# Altium project S905D_MIC_V1.0.PrjPcb
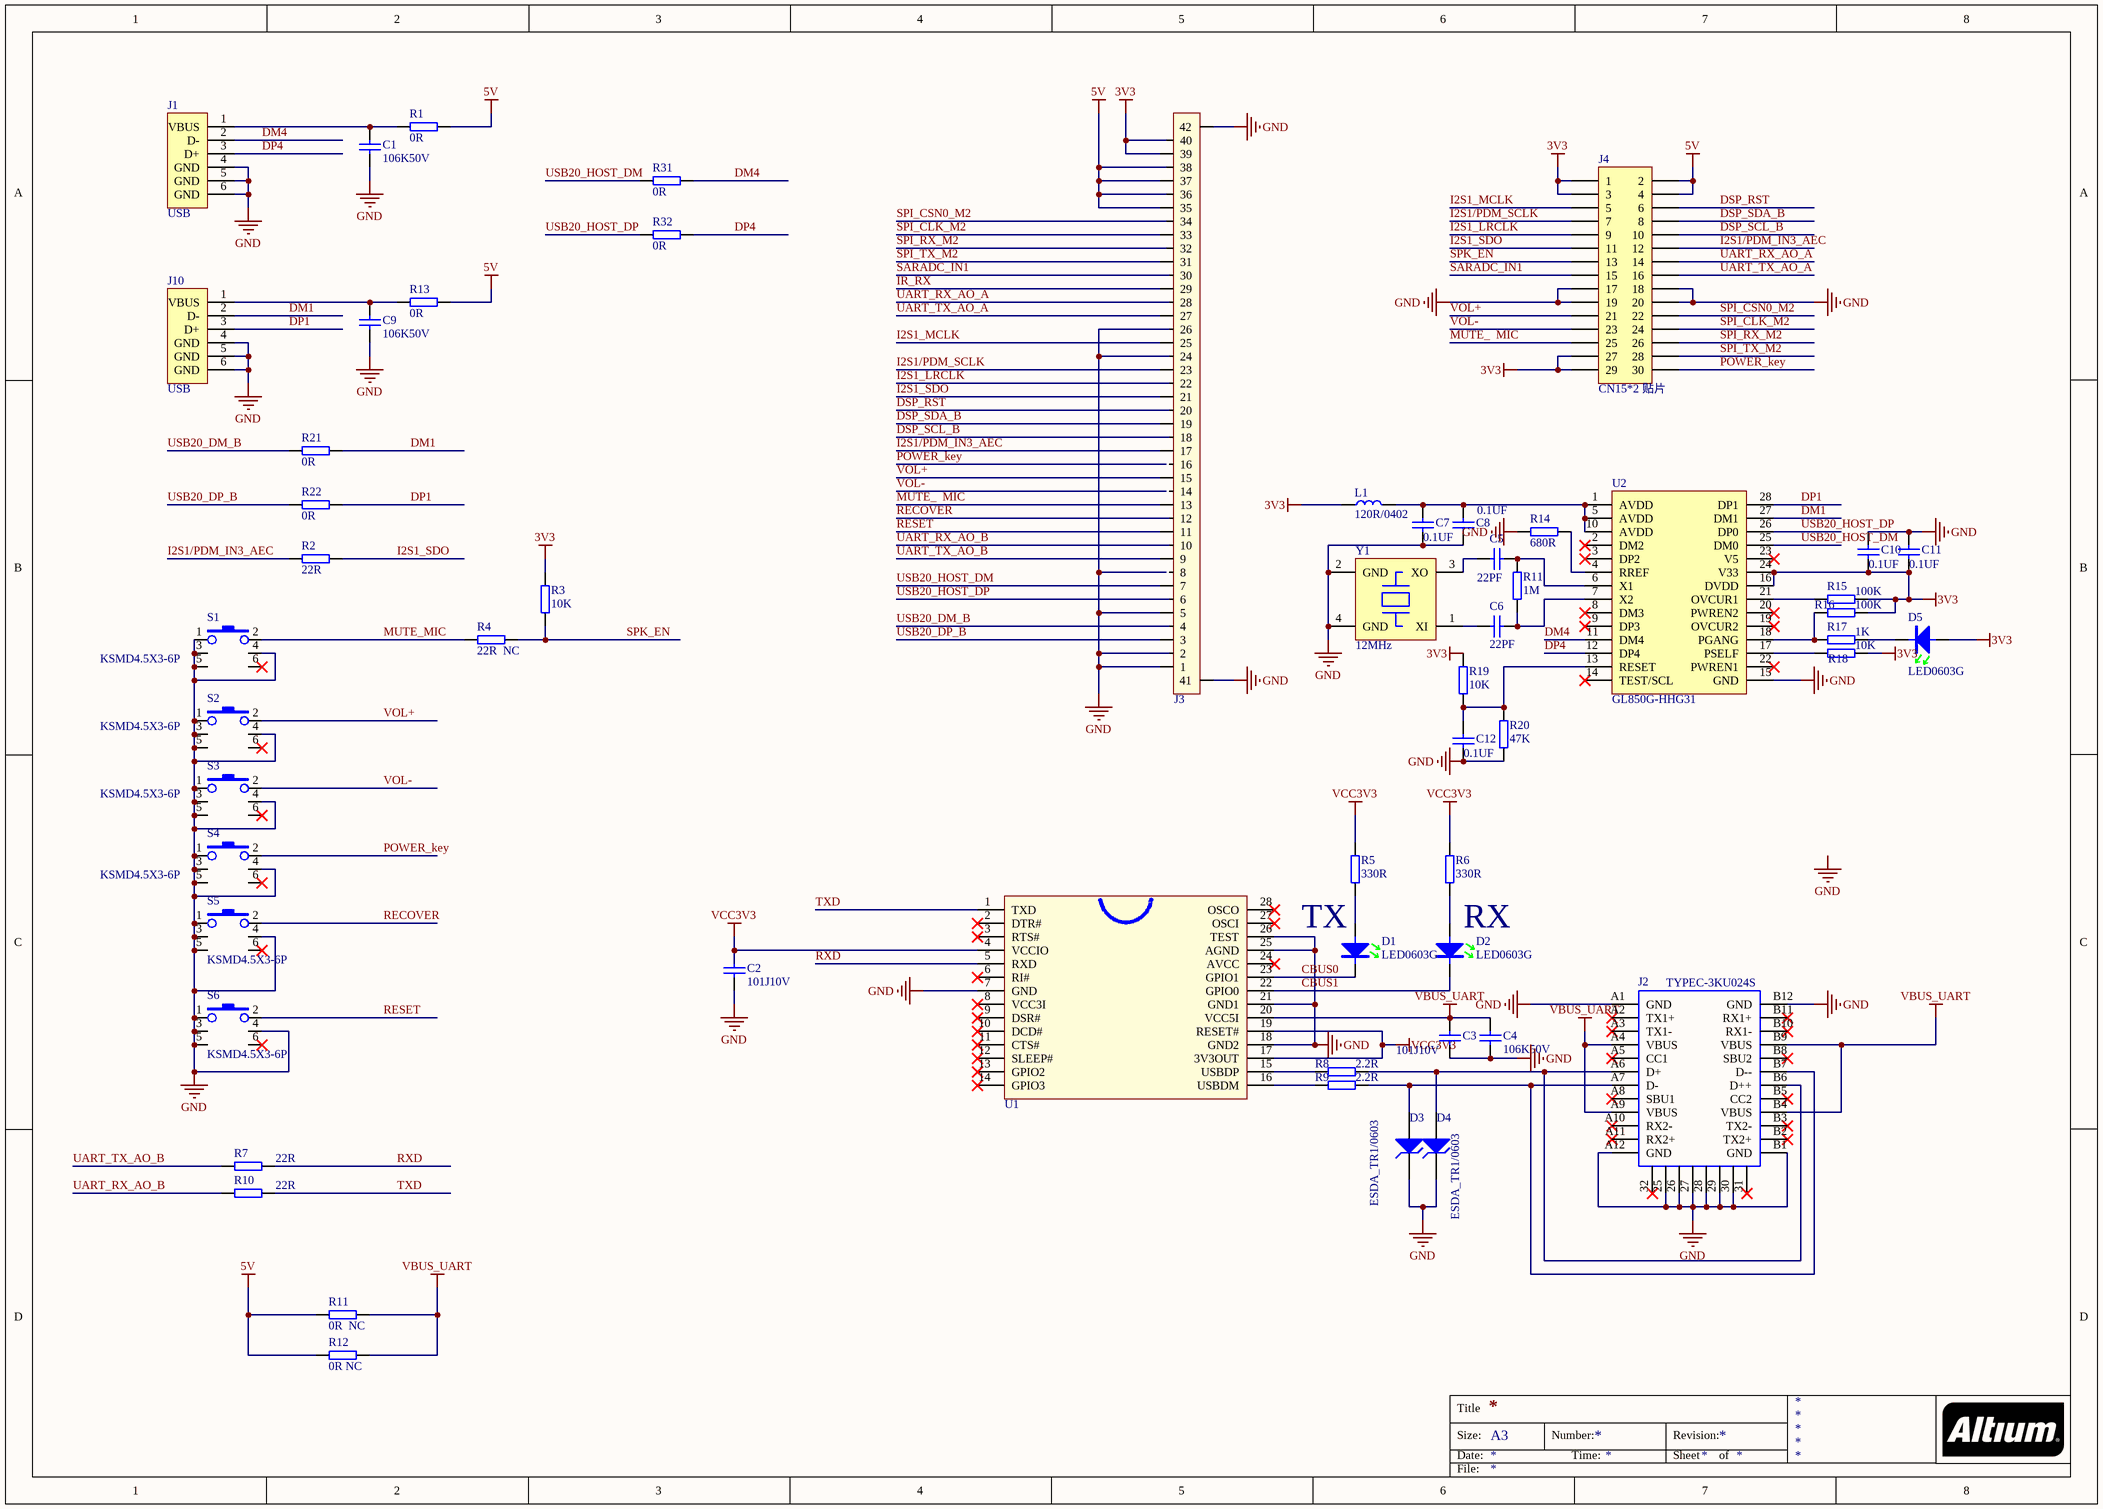
[diagram p0: S905D_MIC_V1.0.SchDoc]
1 sheet, 57 parts. Net scope: global (net labels, ports and power ports of the same name join across sheets).
Board file: S905D_MIC_V1.0.PcbDoc

## Sheet S905D_MIC_V1.0.SchDoc
size A3; PageSetup: Record=PageOptions|CenterHorizontal=True|CenterVertical=True|PrintScale=0.66|XCorrection=1.00|YCorrection=1.00|PrintKind=1|BorderSize=5000000|LeftOffset=0|BottomOffset=0|Orientation=2|PaperLength=1000|PaperWidth=1000|Scale=100|PaperSource=7|PrintQuality=-3|MediaType=1|DitherType=10|PrintScaleMode=1|PaperKind=16K 197x273 毫米¦PaperIndex=155

### Parts
(Parts that share a designator on the sheet are numbered #1, #2 ... from top to bottom, then left to right.)
C1  106K50V  [C0603]
C2  101J10V  [C0402]
C3  101J10V  [C0402]
C4  106K50V  [C0603]
C5  22PF  [C0402]
C6  22PF  [C0402]
C7  0.1UF  [C0402]
C8  0.1UF  [C0402]
C9  106K50V  [C0603]
C10  0.1UF  [C0402]
C11  0.1UF  [C0402]
C12  0.1UF  [C0402]
D1  LED0603G  [D-LED0603G]
D2  LED0603G  [D-LED0603G]
D3  ESDA_TR1/0603  [HS_0603D]
D4  ESDA_TR1/0603  [HS_0603D]
D5  LED0603G  [D-LED0603G]
J1  USB  [USB-A]
J2  TYPEC-3KU024S  [MICRO -TYPE C]
J3  FH34SRJ-40S  [FH34SRJ-40S]  (value not drawn)
J4  CN15*2 贴片  [CN15*2 贴片]
J10  USB  [USB-A]
L1  120R/0402  [C0402]
R1  0R  [R0603]
R2  22R  [R0402]
R3  10K  [R0402]
R4  22R  NC  [R0402]
R5  330R  [R0402]
R6  330R  [R0402]
R7  22R  [R0402]
R8  2.2R  [R0402]
R9  2.2R  [R0402]
R10  22R  [R0402]
R11#1  1M  [R0402]
R11#2  0R  NC  [R0603]
R12  0R NC  [R0603]
R13  0R  [R0603]
R14  680R  [R0402]
R15  100K  [R0402]
R16  100K  [R0402]
R17  1K  [R0402]
R18  10K  [R0402]
R19  10K  [R0402]
R20  47K  [R0402]
R21  0R  [R0402]
R22  0R  [R0402]
R31  0R  [R0402]
R32  0R  [R0402]
S1  KSMD4.5X3-6P  [SKRTLAE010]
S2  KSMD4.5X3-6P  [SKRTLAE010]
S3  KSMD4.5X3-6P  [SKRTLAE010]
S4  KSMD4.5X3-6P  [SKRTLAE010]
S5  KSMD4.5X3-6P  [SKRTLAE010]
S6  KSMD4.5X3-6P  [SKRTLAE010]
U1  FT232R_SOP28  [SSOP28]  (value not drawn)
U2  GL850G-HHG31  [SSOP28]
Y1  12MHz  [Y-CPX-32GA-4P]

### Nets
3V3: C10.2 C11.2 D5.1 J3.39 J3.40 J4.1 J4.3 J4.27 J4.29 L1.1 R3.2 R15.1 R16.1 R18.1 R19.2 U2.16(DVDD) U2.24(V33)
5V: J3.35 J3.36 J3.37 J3.38 J4.2 J4.4 R1.2 R11#2.2 R12.1 R13.2
GND: C1.2 C2.2 C3.2 C4.2 C7.2 C8.2 C9.2 C10.1 C11.1 C12.2 D3.2(K) D4.2(K) J1.4(GND) J1.5(GND) J1.6(GND) J2.25 J2.26(B13) J2.27(B14) J2.28(B15) J2.29(B16) J2.30(B17) J2.A1(GND) J2.A12(GND) J2.B1(GND) J2.B12(GND) J3.1 J3.2 J3.5 J3.24 J3.26 J3.41 J3.42 J4.17 J4.18 J4.19 J4.20 J10.4(GND) J10.5(GND) J10.6(GND) R14.2 R20.1 S1.1 S1.3 S1.4 S1.5 S2.1 S2.3 S2.4 S2.5 S3.1 S3.3 S3.4 S3.5 S4.1 S4.3 S4.4 S4.5 S5.1 S5.3 S5.4 S5.5 S6.1 S6.3 S6.4 S6.5 U1.7(GND) U1.18(GND2) U1.21(GND1) U1.25(AGND) U1.26(TEST) U2.15(GND) Y1.2(GND) Y1.4(GND)
VBUS_UART: C3.1 C4.1 J2.A4(VBUS) J2.A9(VBUS) J2.B4(VBUS) J2.B9(VBUS) R11#2.1 R12.2 U1.20(VCC5I)
VCC3V3: C2.1 R5.2 R6.2 U1.4(VCCIO) U1.17(3V3OUT) U1.19(RESET#)
CBUS0: D1.2 U1.23(GPIO1)
CBUS1: D2.2 U1.22(GPIO0)
DM1: J10.2(D-) R21.2 U2.27(DM1)
DM4: J1.2(D-) R31.2 U2.11(DM4)
DP1: J10.3(D+) R22.2 U2.28(DP1)
DP4: J1.3(D+) R32.2 U2.12(DP4)
DSP_RST: J3.20 J4.6
DSP_SCL_B: J3.18 J4.10
DSP_SDA_B: J3.19 J4.8
I2S1/PDM_IN3_AEC: J3.17 J4.12 R2.1
I2S1/PDM_SCLK: J3.23 J4.7
I2S1_LRCLK: J3.22 J4.9
I2S1_MCLK: J3.25 J4.5
I2S1_SDO: J3.21 J4.11 R2.2
IR_RX: J3.29
MUTE_  MIC: J3.13 J4.25
MUTE_MIC: R4.1 S1.2
POWER_key: J4.30 S4.2
RECOVER: J3.12 S5.2
RESET: J3.11 S6.2
RXD: R7.2 U1.5(RXD)
SARADC_IN1: J3.30 J4.15
SPI_CLK_M2: J3.33 J4.24
SPI_CSN0_M2: J3.34 J4.22
SPI_RX_M2: J3.32 J4.26
SPI_TX_M2: J3.31 J4.28
SPK_EN: J4.13 R3.1 R4.2
TXD: R10.2 U1.1(TXD)
UART_RX_AO_A: J3.28 J4.14
UART_RX_AO_B: J3.10 R10.1
UART_TX_AO_A: J3.27 J4.16
UART_TX_AO_B: J3.9 R7.1
USB20_DM_B: J3.4 R21.1
USB20_DP_B: J3.3 R22.1
USB20_HOST_DM: J3.7 R31.1 U2.25(DM0)
USB20_HOST_DP: J3.6 R32.1 U2.26(DP0)
VOL+: J3.15 J4.21 S2.2
VOL-: J4.23 S3.2
NetC1_1: C1.1 J1.1(VBUS) R1.1
NetC5_1: C5.1 Y1.3(XO)
NetC5_2: C5.2 R11#1.2 U2.6(X1)
NetC6_1: C6.1 Y1.1(XI)
NetC6_2: C6.2 R11#1.1 U2.7(X2)
NetC7_1: C7.1 C8.1 L1.2 U2.1(AVDD) U2.5(AVDD) U2.10(AVDD)
NetC9_1: C9.1 J10.1(VBUS) R13.1
NetC12_1: C12.1 R19.1 R20.2 U2.13(RESET)
NetD1_1: D1.1 R5.1
NetD2_1: D2.1 R6.1
NetD3_1: D3.1(A) J2.A7(D-) J2.B7(D--) R9.2
NetD4_1: D4.1(A) J2.A6(D+) J2.B6(D++) R8.2
NetD5_2: D5.2 R17.1
NetR8_1: R8.1 U1.15(USBDP)
NetR9_1: R9.1 U1.16(USBDM)
NetR14_1: R14.1 U2.4(RREF)
NetR15_2: R15.2 U2.21(OVCUR1)
NetR16_2: R16.2 R17.2 U2.18(PGANG)
NetR18_2: R18.2 U2.17(PSELF)

Not connected (* = marked no-connect by the designer): J2 31(B18)* 32(B13)* A2(TX1+)* A3(TX1-)* A5(CC1)* A8(SBU1)* A10(RX2-)* A11(RX2+)* B2(TX2+)* B3(TX2-)* B5(CC2)* B8(SBU2)* B10(RX1-)* B11(RX1+)*; J3 8 14 16; S1 6(2)*; S2 6(2)*; S3 6(2)*; S4 6(2)*; S5 6(2)*; S6 6(2)*; U1 2(DTR#)* 3(RTS#)* 6(RI#)* 8(VCC3I)* 9(DSR#)* 10(DCD#)* 11(CTS#)* 12(SLEEP#)* 13(GPIO2)* 14(GPIO3)* 24(AVCC)* 27(OSCI)* 28(OSCO)*; U2 2(DM2)* 3(DP2)* 8(DM3)* 9(DP3)* 14(TEST/SCL)* 19(OVCUR2)* 20(PWREN2)* 22(PWREN1)* 23(V5)*

### Notes on the sheet
- TX
- RX
- Labels drawn without touching a wire or pin: GND
- Title
- Size:
- Date:
- A3
- Number:
- Time:
- Revision:
- Sheet
- of
- File:

### Library data of the parts
C1 C4 C9 = C0603X7R-106K50V: 贴片电容-陶瓷; 规格型号: 10uF±10%_50V_X7R_C0603; 生产商: 风华 三星; 供应商: *; 备注: *
C2 C3 C5-C8 C10-C12 = C0402X7R-101J10V: 贴片电容-陶瓷; 规格型号: 100pF±5%_10V_X7R_C0402; 生产商: 风华 三星; 供应商: *; 备注: *
D1 D2 D5 = DLED-0603-G: 贴片二极管-LED; 规格型号: 0603-GREEN; 货品编码: 无样品无编码; 生产商: *; 供应商: *; 备注: *
D3 D4 = D Zener: Zener Diode; Published: *; LatestRevisionDate: *; LatestRevisionNote: *; PackageReference: *; Publisher: *
J2 = TYPEC-3KU024S: DIP Switch; Published: 24-Mar-1999; LatestRevisionDate: 17-Jul-2002; LatestRevisionNote: Re-released for DXP Platform.; PackageReference: DIP-18; Publisher: Altium Limited; Code_JEDEC: MO-036-AE
J3 = SFH34SRJ-40S: 贴片FPC40PIN插座; PCB DECAL: SIP-8P
L1 = 3.3uH: 贴片电感-屏蔽; 生产商: *; 供应商: *; 备注: *
R1 R11#2 R12 R13 = R0603-0R: 贴片电阻-通用; 生产商: 厚声 国巨; 规格型号: 0R_1/10W_±200ppm_R0603; 货品编码: 无样品无编码; 备注: *; 供应商: *
R2-R10 R11#1 R14-R22 R31 R32 = R0402-1KF: 贴片电阻-通用; 生产商: 厚声 国巨; 规格型号: 1K±1%_1/10W_±200ppm_R0402; 备注: *; 供应商: *
S1-S6 = KSMD4.5X3-6P: 贴片侧按键; 货品编码: 232013; 规格型号: 6x6 SMD贴片按键; 备注: *; 供应商: *; 生产商: *
U1 = FT232R_SOP28: USB 转串口芯片; 物料代码: 2.01.08.075
Y1 = YC-26MHz: 晶振-贴片无源; 规格型号: 26MHz_贴片晶振3225; 货品编码: 无样品无编码; 生产商: *; 供应商: *; 备注: *